# Altium project MPPT design board.PrjPcb
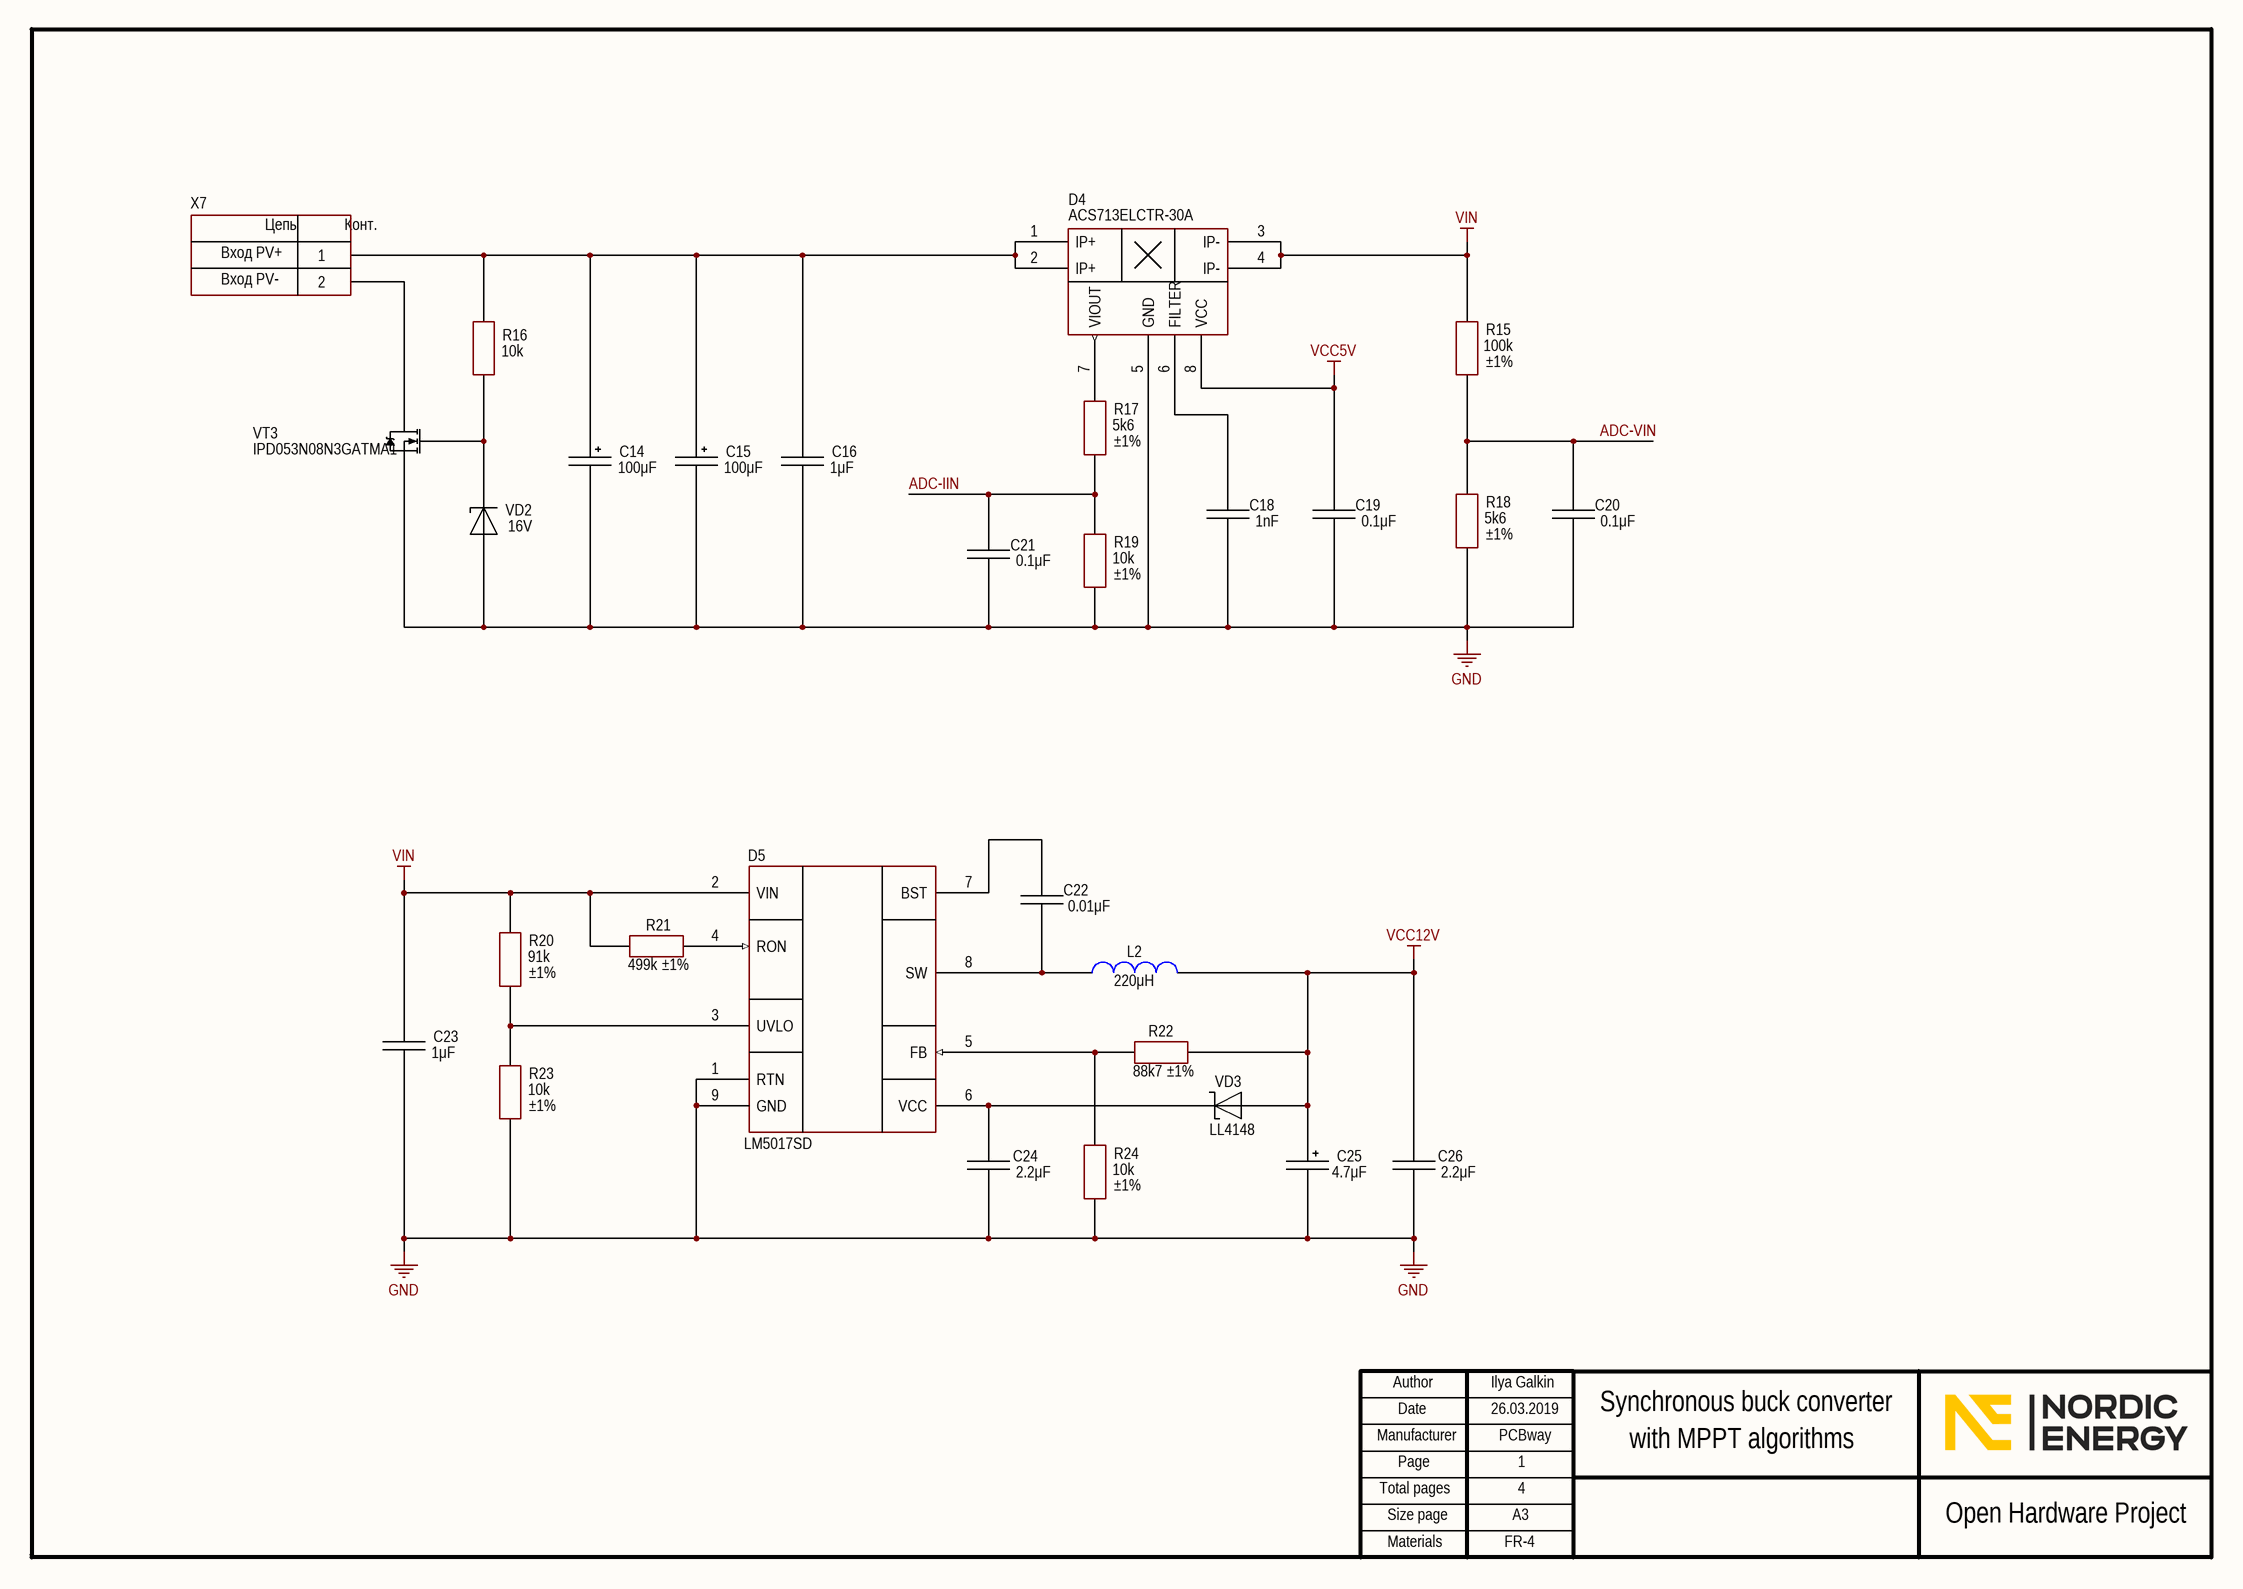
[diagram p0: Input circuits. Page 1.SchDoc]
4 sheets, 93 parts. Net scope: global (net labels, ports and power ports of the same name join across sheets).
Board file: PCB for MPPT design board.PcbDoc
Sheets:
  Input circuits. Page 1.SchDoc
  Buck converter. Page 2.SchDoc
  Output curcuits. Page 3.SchDoc
  Control board. Page 4.SchDoc

## Sheet Input circuits. Page 1.SchDoc
size 420 x 297 mm; Address1: Address1; Address2: Address2; Address3: Address3; Address4: Address4; DocumentNumber: АБВГ.123456.001 Э3; SheetNumber: 1; SheetTotal: 4; Scale: 1:1; DocumentType: Схема электрическая принципиальная; FirstReferrence: АБВГ.123456.001

### Parts
C14  100μF  [D10C5H12.5]
C15  100μF  [D10C5H12.5]
C16  1μF  [CH1206C]
C18  1nF  [CH0805C]
C19  0.1μF  [CH0805C]
C20  0.1μF  [CH0805C]
C21  0.1μF  [CH0805C]
C22  0.01μF  [CH0805C]
C23  1μF  [CH1206C]
C24  2.2μF  [CH0805C]
C25  4.7μF  [TANTAL_B]
C26  2.2μF  [CH0805C]
D4  ACS713ELCTR-30A  [8-SOIC]
D5  LM5017SD  [8-WDFN (4x4 mm)]
L2  220μH  [IND: SDR0805]
R15  100k  ComponentKind: ±1%  [CH0805R]
R16  10k  [CH0805R]
R17  5k6  ComponentKind: ±1%  [CH0805R]
R18  5k6  ComponentKind: ±1%  [CH0805R]
R19  10k  ComponentKind: ±1%  [CH0805R]
R20  91k  ComponentKind: ±1%  [CH0805R]
R21  499k  ComponentKind: ±1%  [CH0805R]
R22  88k7  ComponentKind: ±1%  [CH0805R]
R23  10k  ComponentKind: ±1%  [CH0805R]
R24  10k  ComponentKind: ±1%  [CH0805R]
VD2  16V  [SOD80]
VD3  LL4148  [SOD80]
VT3  IPD053N08N3GATMA1  [D2PAK]
X7  6PCV-02-006  [CON: 6PCV-02-006]  (value not drawn)

### Nets
GND: C14.2 C15.2 C16.2 C18.1 C19.1 C20.1 C21.1 C23.2 C24.1 C25.2 C26.1 D4.5(GND) D5.1(RTN) D5.9(GND) R18.1 R19.1 R23.1 R24.1 VD2.1(A) VT3.3(S)
VCC5V: C19.2 D4.8(VCC)
VCC12V: C25.1 C26.2 L2.1 R22.1 VD3.1
VIN: C23.1 D4.3(IP-) D4.4(IP-) D5.2(VIN) R15.2 R20.2 R21.2
ADC-IIN: C21.2 R17.1 R19.2
ADC-VIN: C20.2 R15.1 R18.2
NetC14_1: C14.1 C15.1 C16.1 D4.1(IP+) D4.2(IP+) R16.2 X7.1
NetC18_2: C18.2 D4.6(FILTER)
NetC22_1: C22.1 D5.8(SW) L2.2
NetC22_2: C22.2 D5.7(BST)
NetC24_2: C24.2 D5.6(VCC) VD3.2
NetD4_7: D4.7(VIOUT) R17.2
NetD5_3: D5.3(UVLO) R20.1 R23.2
NetD5_4: D5.4(RON) R21.1
NetD5_5: D5.5(FB) R22.2 R24.2
NetR16_1: R16.1 VD2.2(C) VT3.1(G)
NetVT3_2: VT3.2(D) X7.2

### Notes on the sheet
- Вход PV+
- Вход PV-
- Ilya Galkin
- 26.03.2019
- PCBway
- 1
- Synchronous buck converter
- with MPPT algorithms
- 4
- FR-4
- Author
- Manufacturer
- Date
- Page
- Total pages
- Size page
- A3
- Open Hardware Project
- Materials
- (in symbol 2-Connector) Цепь; Конт.

### Library data of the parts
C14 C15 = AlumCap: Manufacturer: Wurth; Model: 860010775014; HelpURL: https://www.digikey.com/product-detail/en/wurth-electronics-inc/860010775014/732-8771-1-ND/5728718; ComponentKind: 63V; Value: 100μF
C16 C23 = Capacitor: Manufacturer: Samsung; Model: CL31B105KCHSNNE; HelpURL: https://www.digikey.com/product-detail/en/samsung-electro-mechanics/CL31B105KCHSNNE/1276-2747-1-ND/3890833; ComponentKind: X7R; Value: 1μF
C18 = Capacitor: Manufacturer: Yageo; Model: CC0805KRX7R9BB102; HelpURL: https://www.digikey.com/product-detail/en/yageo/CC0805KRX7R9BB102/311-1127-1-ND/303037; ComponentKind: X7R; Value: 1nF
C19-C21 = Capacitor: Manufacturer: Yageo; Model: CC0805KRX7R8BB104; HelpURL: https://www.digikey.com/product-detail/en/yageo/CC0805KRX7R8BB104/311-1141-1-ND/303051; ComponentKind: X7R; Value: 0.1μF
C22 = Capacitor: Manufacturer: Yageo; Model: CC0805KRX7R9BB103; HelpURL: https://www.digikey.com/product-detail/en/yageo/CC0805KRX7R9BB103/311-1136-1-ND/303046; ComponentKind: X7R; Value: 0.01μF
C24 C26 = Capacitor: Manufacturer: Yageo; Model: CC0805KKX7R7BB225; HelpURL: https://www.digikey.com/product-detail/en/yageo/CC0805KKX7R7BB225/311-1881-1-ND/5195783; ComponentKind: X7R; Value: 2.2μF
C25 = TantalCap: Manufacturer: AVX; Model: TAJA475K025RNJ; HelpURL: https://www.digikey.com/product-detail/en/avx-corporation/TAJA475K025RNJ/478-11053-1-ND/7536161; ComponentKind: 25V; Value: 4.7μF
D4 = ACS713ELCTR-30A-T: Sensor; Manufacturer: Allegro MicroSystems, LLC; Model: ACS713ELCTR-30A-T; HelpURL: https://www.digikey.com/product-detail/en/allegro-microsystems-llc/ACS713ELCTR-30A-T/620-1193-1-ND/1284610; ComponentKind: 8-SOIC
D5 = LM5017SD: Step-down; Manufacturer: Texas Instruments; Model: LM5017SD/NOPB; HelpURL: https://www.digikey.com/product-detail/en/texas-instruments/LM5017SD-NOPB/LM5017SD-NOPBCT-ND/3137455; ComponentKind: 8-WDFN
L2 = Inductor: Manufacturer: Bourns; Model: SDR0805-221KL; HelpURL: https://www.digikey.com/product-detail/en/bourns-inc/SDR0805-221KL/SDR0805-221KLCT-ND/2127164; ComponentKind: 490mA; Value: 220μH
R15 = Resistor: Manufacturer: Yageo; Model: RC0805FR-07100KL; HelpURL: https://www.digikey.com/product-detail/en/yageo/RC0805FR-07100KL/311-100KCRCT-ND/730491; Value: 100k
R16 = Resistor: Manufacturer: Yageo; Model: RC0805JR-0710KL; HelpURL: https://www.digikey.com/product-detail/en/yageo/RC0805JR-0710KL/311-10KARCT-ND/731188; ComponentKind: ±5%; Value: 10k
R17 R18 = Resistor: Manufacturer: Yageo; Model: RC0805FR-075K6L; HelpURL: https://www.digikey.com/product-detail/en/yageo/RC0805FR-075K6L/311-5.60KCRCT-ND/730949; Value: 5k6
R19 R23 R24 = Resistor: Manufacturer: Yageo; Model: RC0805FR-0710KL; HelpURL: https://www.digikey.com/product-detail/en/yageo/RC0805FR-0710KL/311-10.0KCRCT-ND/730482; Value: 10k
R20 = Resistor: Manufacturer: Yageo; Model: RC0805FR-0791KL; HelpURL: https://www.digikey.com/product-detail/en/yageo/RC0805FR-0791KL/311-91.0KCRCT-ND/731149; Value: 91k
R21 = Resistor: Manufacturer: Yageo; Model: RC0805FR-07499KL; HelpURL: https://www.digikey.com/product-detail/en/yageo/RC0805FR-07499KL/311-499KCRCT-ND/730934; Value: 499k
R22 = Resistor: Manufacturer: Yageo; Model: RC0805FR-0788K7L; HelpURL: https://www.digikey.com/product-detail/en/yageo/RC0805FR-0788K7L/311-88.7KCRCT-ND/731128; Value: 88k7
VD2 = Diod Zener: Manufacturer: Central Semiconductor; Model: CLL5246B TR; ComponentKind: 16V; HelpURL: https://www.digikey.com/product-detail/en/central-semiconductor-corp/CLL5246B-TR/CLL5246BCT-ND/5324392
VD3 = Diod Schottky: Manufacturer: ON Semiconductor; ComponentKind: 100V; Model: LL4148; HelpURL: https://www.digikey.com/product-detail/en/on-semiconductor/LL4148/LL4148FSCT-ND/1923118
VT3 = N-chanel: Mosfet; Manufacturer: Infineon; Model: IPD053N08N3GATMA1; ComponentKind: 80V; HelpURL: https://www.digikey.com/product-detail/en/infineon-technologies/IPD053N08N3GATMA1/IPD053N08N3GATMA1CT-ND/5353500
X7 = 2-Connector: Manufacturer: TE Connectivity; Model: 6PCV-02-006; HelpURL: https://www.digikey.com/products/en?keywords=6pcv-02-006; ComponentKind: 25A

## Sheet Buck converter. Page 2.SchDoc
size 420 x 297 mm; Address1: Address1; Address2: Address2; Address3: Address3; Address4: Address4; DocumentNumber: АБВГ.123456.001 Э3; SheetNumber: 2; SheetTotal: 4; Scale: 1:1; DocumentType: Схема электрическая принципиальная; FirstReferrence: АБВГ.123456.001
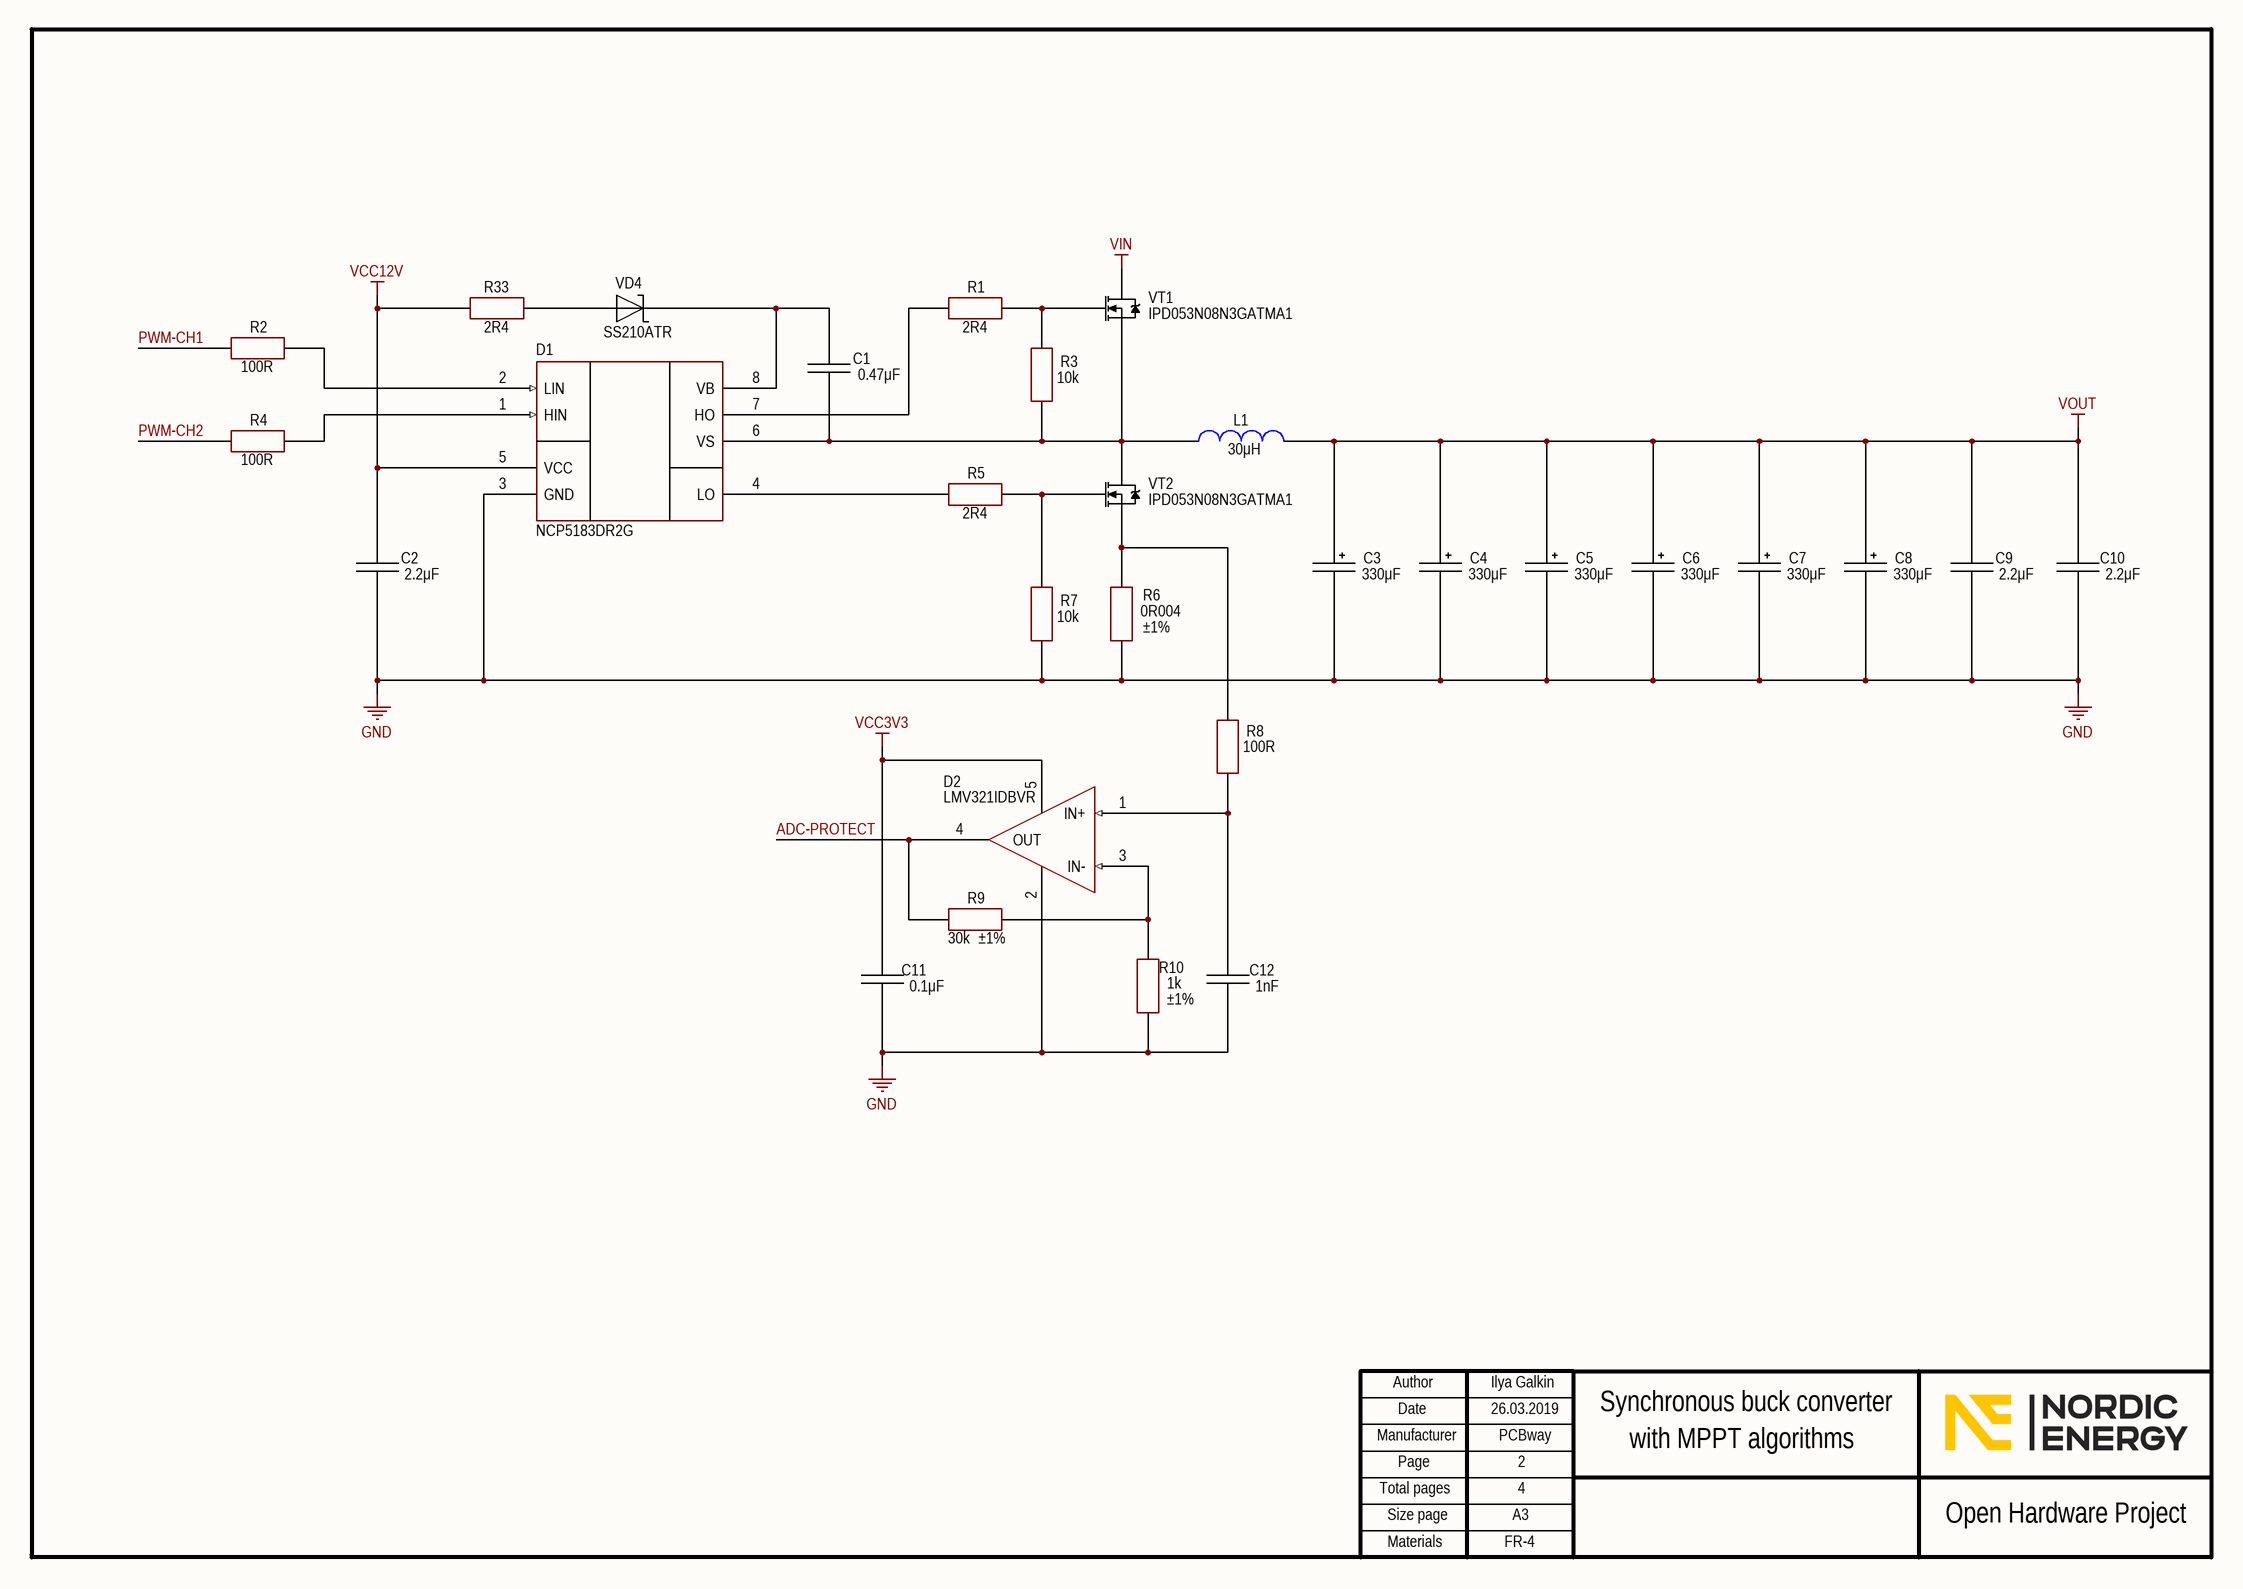
[diagram p1: Buck converter. Page 2.SchDoc]

### Parts
C1  0.47μF  [CH1206C]
C2  2.2μF  [CH1206C]
C3  330μF  [D10C5H12.5]
C4  330μF  [D10C5H12.5]
C5  330μF  [D10C5H12.5]
C6  330μF  [D10C5H12.5]
C7  330μF  [D10C5H12.5]
C8  330μF  [D10C5H12.5]
C9  2.2μF  [CH1206C]
C10  2.2μF  [CH1206C]
C11  0.1μF  [CH0805C]
C12  1nF  [CH0805C]
D1  NCP5183DR2G  [8-SOIC]
D2  LMV321IDBVR  [SOT23-5]
L1  30μH  [IND: R32.8/20.1/10.7 (L)]
R1  2R4  [CH0805R]
R2  100R  [CH0805R]
R3  10k  [CH0805R]
R4  100R  [CH0805R]
R5  2R4  [CH0805R]
R6  0R004  ComponentKind: ±1%  [CH2512R]
R7  10k  [CH0805R]
R8  100R  [CH0805R]
R9  30k  ComponentKind: ±1%  [CH0805R]
R10  1k  ComponentKind: ±1%  [CH0805R]
R33  2R4  [CH0805R]
VD4  SS210ATR  [SMA]
VT1  IPD053N08N3GATMA1  [D2PAK]
VT2  IPD053N08N3GATMA1  [D2PAK]

### Nets
GND: C2.1 C3.2 C4.2 C5.2 C6.2 C7.2 C8.2 C9.1 C10.1 C11.1 C12.1 D1.3(GND) D2.2(V-) R6.2 R7.1 R10.2
VCC3V3: C11.2 D2.5(V+)
VCC12V: C2.2 D1.5(VCC) R33.2
VIN: VT1.2(D)
VOUT: C3.1 C4.1 C5.1 C6.1 C7.1 C8.1 C9.2 C10.2 L1.1
ADC-PROTECT: D2.4(OUT) R9.2
PWM-CH1: R2.1
PWM-CH2: R4.1
NetC1_1: C1.1 D1.6(VS) L1.2 R3.1 VT1.3(S) VT2.2(D)
NetC1_2: C1.2 D1.8(VB) VD4.2
NetC12_2: C12.2 D2.1(IN+) R8.2
NetD1_1: D1.1(HIN) R4.2
NetD1_2: D1.2(LIN) R2.2
NetD1_4: D1.4(LO) R5.2
NetD1_7: D1.7(HO) R1.2
NetD2_3: D2.3(IN-) R9.1 R10.1
NetR1_1: R1.1 R3.2 VT1.1(G)
NetR5_1: R5.1 R7.2 VT2.1(G)
NetR6_1: R6.1 R8.1 VT2.3(S)
NetR33_1: R33.1 VD4.1

### Notes on the sheet
- Ilya Galkin
- 26.03.2019
- PCBway
- 2
- Synchronous buck converter
- with MPPT algorithms
- 4
- FR-4
- Author
- Manufacturer
- Date
- Page
- Total pages
- Size page
- A3
- Open Hardware Project
- Materials

### Library data of the parts
C1 = Capacitor: Manufacturer: Yageo; Model: CC1206KRX7R8BB474; HelpURL: https://www.digikey.com/product-detail/en/yageo/CC1206KRX7R8BB474/311-3576-1-ND/7648503; ComponentKind: X7R; Value: 0.47μF
C2 C9 C10 = Capacitor: Manufacturer: Yageo; Model: CC1206KKX7R9BB225; HelpURL: https://www.digikey.com/product-detail/en/yageo/CC1206KKX7R9BB225/311-1964-1-ND/5195866; ComponentKind: X7R; Value: 2.2μF
C3-C8 = AlumCap: Manufacturer: Panasonic; Model: 35SEK330M; HelpURL: https://www.digikey.com/product-detail/en/panasonic-electronic-components/35SEK330M/P122629-ND/8030545; ComponentKind: 35V; Value: 330μF
C11 = Capacitor: as C19 on sheet Input circuits. Page 1; HelpURL: https://www.digikey.com/product-detail/en/yageo/CC0805KRX7R8BB104/311-1141-1-ND/303051; ComponentKind: X7R; Value: 0.1μF
C12 = Capacitor: as C18 on sheet Input circuits. Page 1; HelpURL: https://www.digikey.com/product-detail/en/yageo/CC0805KRX7R9BB102/311-1127-1-ND/303037; ComponentKind: X7R; Value: 1nF
D1 = NCP5183DR2G: Half-bridge; Manufacturer: ON Semiconductor; Model: NCP5183DR2G; HelpURL: https://www.digikey.com/product-detail/en/on-semiconductor/NCP5183DR2G/NCP5183DR2GOSCT-ND/7066807; ComponentKind: SO-8
D2 = LMV321IDBVR: Amplifer; Manufacturer: Texas Instruments; Model: LMV321IDBVR; ComponentKind: SOT-23-5; HelpURL: https://www.digikey.com/product-detail/en/texas-instruments/LMV321IDBVR/296-9567-1-ND/379849
L1 = Inductor ring: Manufacturer: Magnetics; Model: 0077071A7; Value: 30μH; ComponentKind: R32.8x20.1x10.7; HelpURL: http://ferrite.ru/warehouse/r-32-820-110-7-77071-a7.html
R1 R5 R33 = Resistor: Manufacturer: Yageo; Model: RC0805JR-072R4L; HelpURL: https://www.digikey.com/product-detail/en/yageo/RC0805JR-072R4L/311-2.4ARCT-ND/731220; ComponentKind: ±5%; Value: 2R4
R2 R4 R8 = Resistor: Manufacturer: Yageo; Model: RC0805JR-07100RL; HelpURL: https://www.digikey.com/product-detail/en/yageo/RC0805JR-07100RL/311-100ARCT-ND/731185; ComponentKind: ±5%; Value: 100R
R3 R7 = Resistor: as R16 on sheet Input circuits. Page 1; HelpURL: https://www.digikey.com/product-detail/en/yageo/RC0805JR-0710KL/311-10KARCT-ND/731188; ComponentKind: ±5%; Value: 10k
R6 = Resistor: Manufacturer: Yageo; Model: PA2512FKF7W0R004E; HelpURL: https://www.digikey.com/product-detail/en/yageo/PA2512FKF7W0R004E/YAG2144CT-ND/5139592; Value: 0R004
R9 = Resistor: Manufacturer: Yageo; Model: RC0805FR-0730KL; HelpURL: https://www.digikey.com/product-detail/en/yageo/RC0805FR-0730KL/311-30.0KCRCT-ND/730790; Value: 30k
R10 = Resistor: Manufacturer: Yageo; Model: RC0805FR-071KL; HelpURL: https://www.digikey.com/product-detail/en/yageo/RC0805FR-071KL/311-1.00KCRCT-ND/730391; Value: 1k
VD4 = Diod Schottky: Manufacturer: SMC Diode; ComponentKind: 100V 2A; Model: SS210ATR; HelpURL: https://www.digikey.com/product-detail/en/smc-diode-solutions/SS210ATR/1655-1896-1-ND/7914879
VT1 VT2 = N-chanel: Mosfet; Manufacturer: Infineon; Model: IPD053N08N3GATMA1; ComponentKind: 80V; HelpURL: https://www.digikey.com/product-detail/en/infineon-technologies/IPD053N08N3GATMA1/IPD053N08N3GATMA1CT-ND/5353500

## Sheet Output curcuits. Page 3.SchDoc
size 420 x 297 mm; Address1: Address1; Address2: Address2; Address3: Address3; Address4: Address4; DocumentNumber: АБВГ.123456.001 Э3; SheetNumber: 3; SheetTotal: 4; Scale: 1:1; DocumentType: Схема электрическая принципиальная; FirstReferrence: АБВГ.123456.001
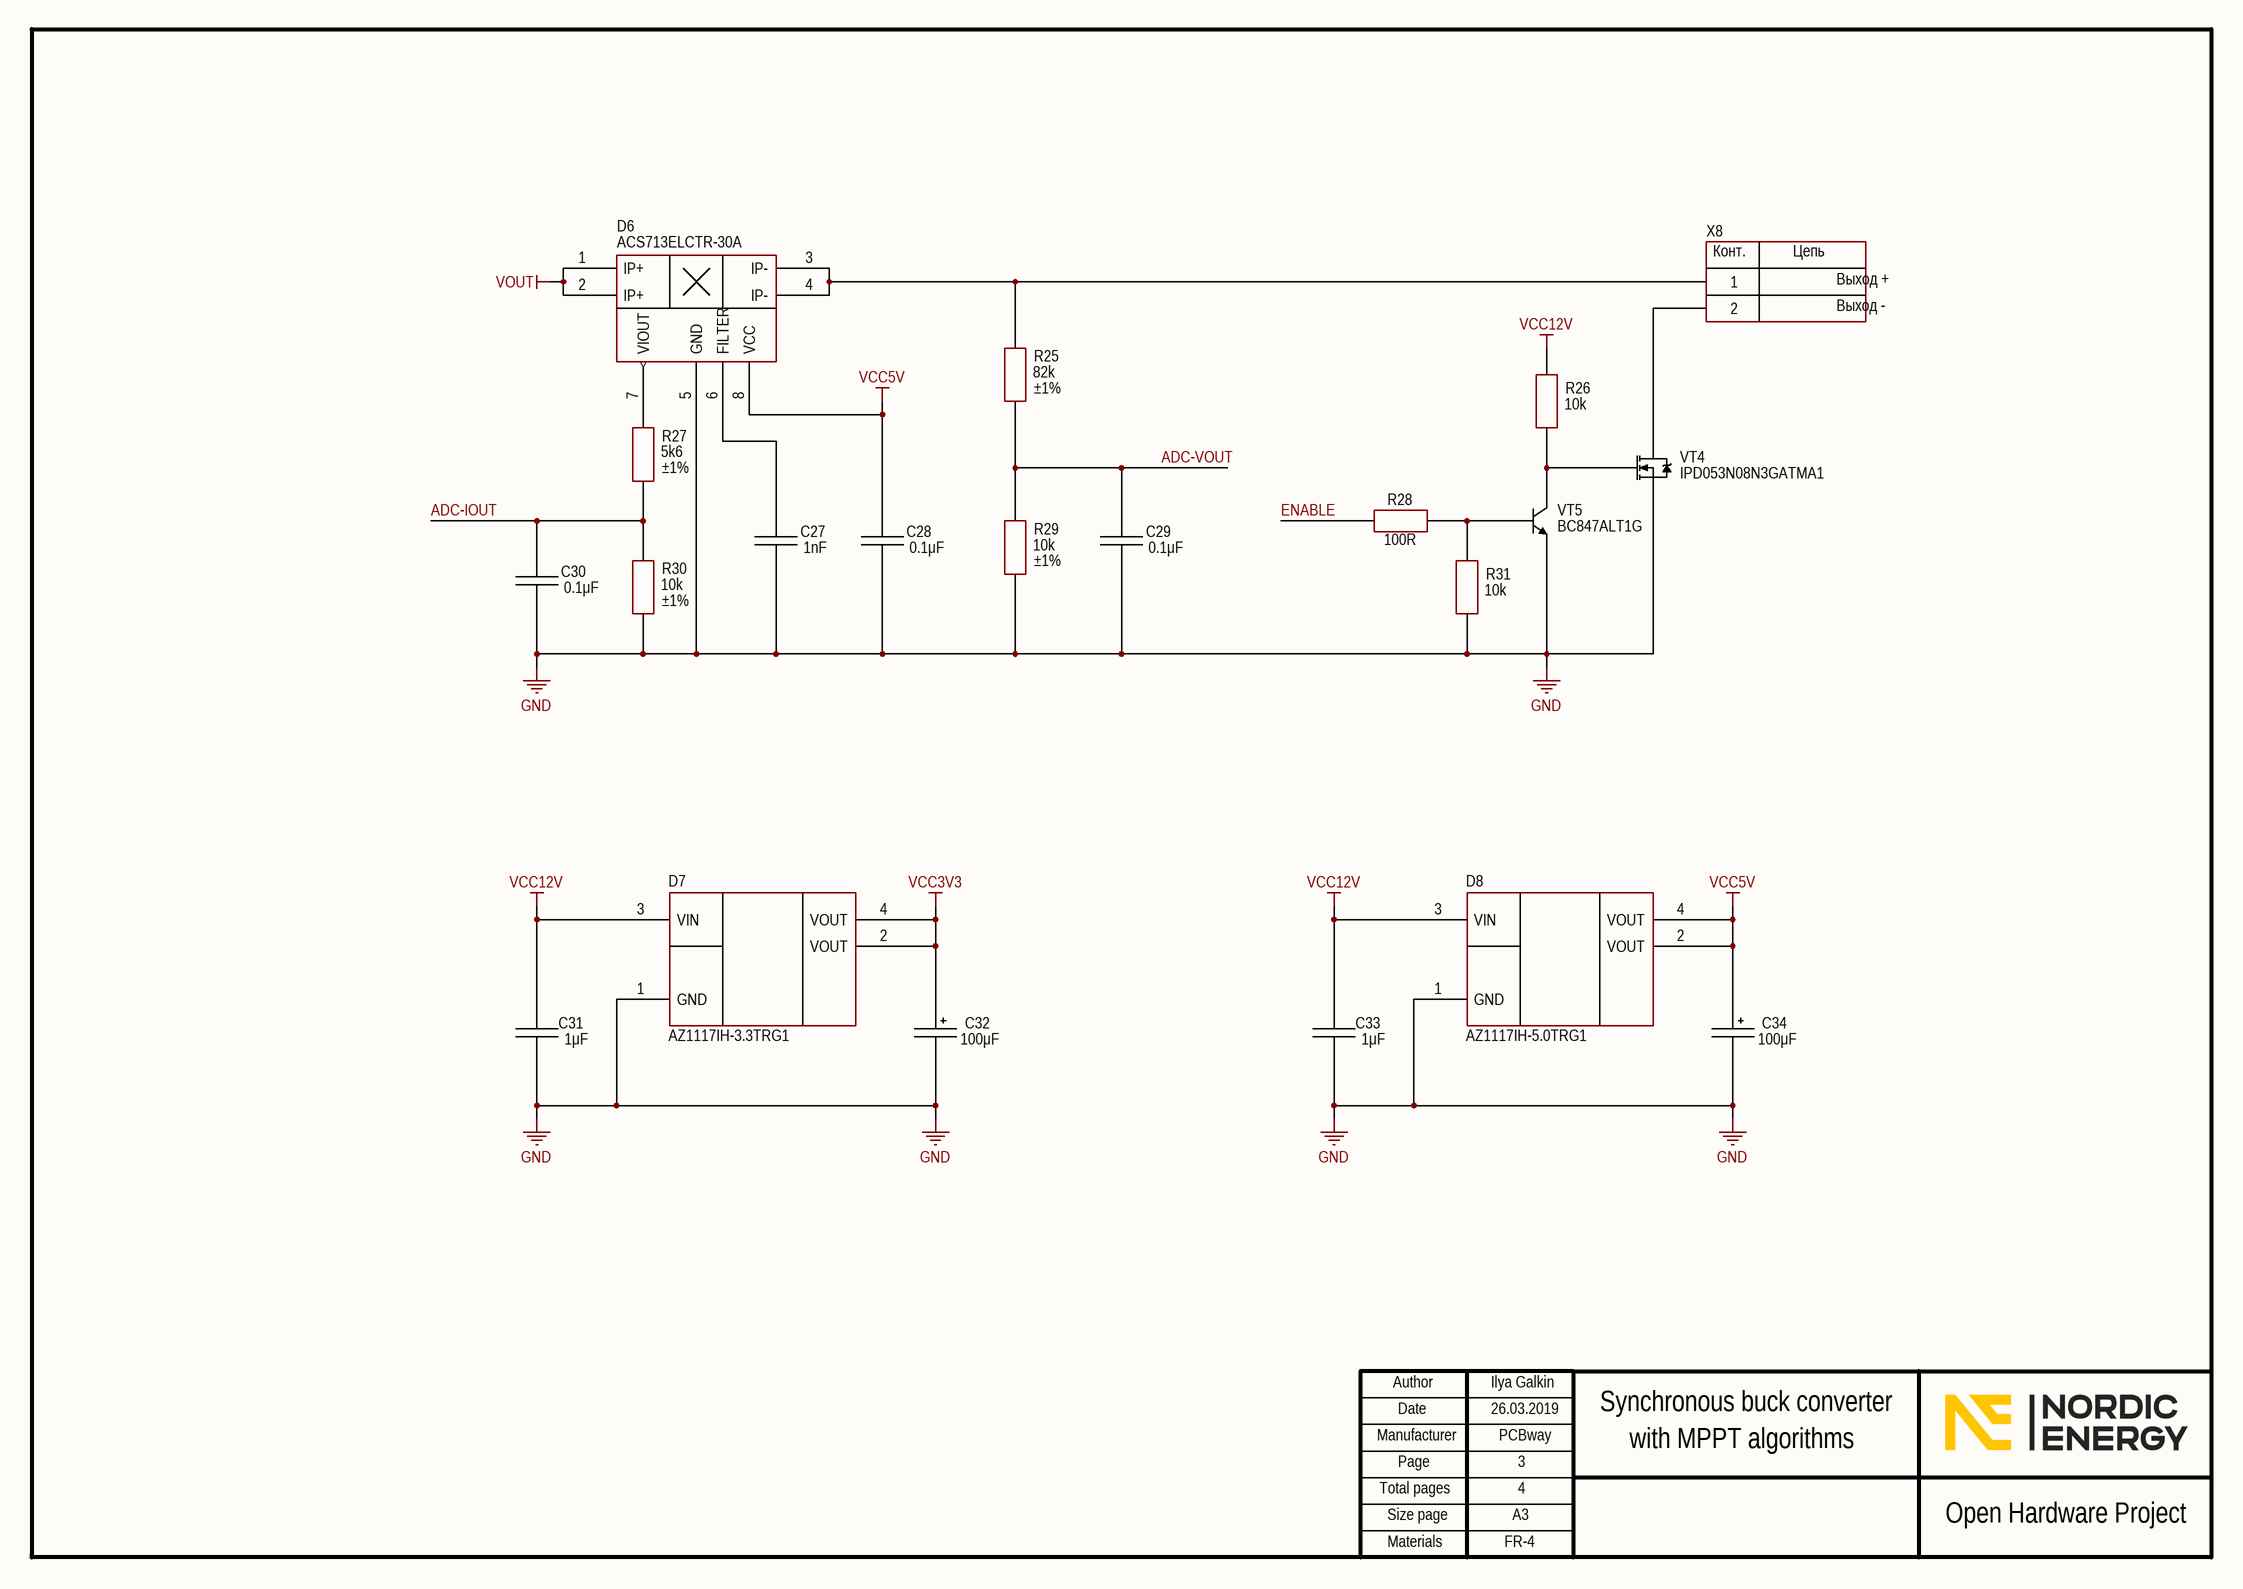
[diagram p2: Output curcuits. Page 3.SchDoc]

### Parts
C27  1nF  [CH0805C]
C28  0.1μF  [CH0805C]
C29  0.1μF  [CH0805C]
C30  0.1μF  [CH0805C]
C31  1μF  [CH0805C]
C32  100μF  [TANTAL_A]
C33  1μF  [CH0805C]
C34  100μF  [TANTAL_A]
D6  ACS713ELCTR-30A  [8-SOIC]
D7  AZ1117IH-3.3TRG1  [SOT223]
D8  AZ1117IH-5.0TRG1  [SOT223]
R25  82k  ComponentKind: ±1%  [CH0805R]
R26  10k  [CH0805R]
R27  5k6  ComponentKind: ±1%  [CH0805R]
R28  100R  [CH0805R]
R29  10k  ComponentKind: ±1%  [CH0805R]
R30  10k  ComponentKind: ±1%  [CH0805R]
R31  10k  [CH0805R]
VT4  IPD053N08N3GATMA1  [D2PAK]
VT5  BC847ALT1G  [SOT23_123]
X8  6PCV-02-006  [CON: 6PCV-02-006]  (value not drawn)

### Nets
GND: C27.1 C28.1 C29.1 C30.1 C31.1 C32.2 C33.1 C34.2 D6.5(GND) D7.1(GND) D8.1(GND) R29.1 R30.1 R31.1 VT4.3(S) VT5.3(E)
VCC3V3: C32.1 D7.2(VOUT) D7.4(VOUT)
VCC5V: C28.2 C34.1 D6.8(VCC) D8.2(VOUT) D8.4(VOUT)
VCC12V: C31.2 C33.2 D7.3(VIN) D8.3(VIN) R26.2
VOUT: D6.1(IP+) D6.2(IP+)
ADC-IOUT: C30.2 R27.1 R30.2
ADC-VOUT: C29.2 R25.1 R29.2
ENABLE: R28.1
NetC27_2: C27.2 D6.6(FILTER)
NetD6_3: D6.3(IP-) D6.4(IP-) R25.2 X8.1
NetD6_7: D6.7(VIOUT) R27.2
NetR26_1: R26.1 VT4.1(G) VT5.2(C)
NetR28_2: R28.2 R31.2 VT5.1(B)
NetVT4_2: VT4.2(D) X8.2

### Notes on the sheet
- Выход +
- Выход -
- Ilya Galkin
- 26.03.2019
- PCBway
- 3
- Synchronous buck converter
- with MPPT algorithms
- 4
- FR-4
- Author
- Manufacturer
- Date
- Page
- Total pages
- Size page
- A3
- Open Hardware Project
- Materials
- (in symbol 2-Connector) Конт.; Цепь

### Library data of the parts
C27 = Capacitor: as C18 on sheet Input circuits. Page 1; HelpURL: https://www.digikey.com/product-detail/en/yageo/CC0805KRX7R9BB102/311-1127-1-ND/303037; ComponentKind: X7R; Value: 1nF
C28-C30 = Capacitor: as C19 on sheet Input circuits. Page 1; HelpURL: https://www.digikey.com/product-detail/en/yageo/CC0805KRX7R8BB104/311-1141-1-ND/303051; ComponentKind: X7R; Value: 0.1μF
C31 C33 = Capacitor: Manufacturer: Yageo; Model: CC0805JKX7R7BB105; HelpURL: https://www.digikey.com/product-detail/en/yageo/CC0805JKX7R7BB105/311-3497-1-ND/7164518; ComponentKind: X7R; Value: 1μF
C32 C34 = TantalCap: Manufacturer: AVX; Model: TLJA107M006R0800; HelpURL: https://www.digikey.com/product-detail/en/avx-corporation/TLJA107M006R0800/478-11096-1-ND/7536303; ComponentKind: 6.3V; Value: 100μF
D6 = ACS713ELCTR-30A-T: as D4 on sheet Input circuits. Page 1; Model: ACS713ELCTR-30A-T; HelpURL: https://www.digikey.com/product-detail/en/allegro-microsystems-llc/ACS713ELCTR-30A-T/620-1193-1-ND/1284610; ComponentKind: 8-SOIC
D7 D8 = LDL1117S33R: LDO; Manufacturer: Diodes Incorporated; ComponentKind: SOT-223
  D7: Model: AZ1117IH-3.3TRG1; HelpURL: https://www.digikey.com/product-detail/en/diodes-incorporated/AZ1117IH-3.3TRG1/AZ1117IH-3.3TRG1DIDKR-ND/5699692
  D8: Model: AZ1117IH-5.0TRG1; HelpURL: https://www.digikey.com/product-detail/en/diodes-incorporated/AZ1117IH-5.0TRG1/AZ1117IH-5.0TRG1DICT-ND/5699683
R25 = Resistor: Manufacturer: Yageo; Model: RC0805FR-0782KL; HelpURL: https://www.digikey.com/product-detail/en/yageo/RC0805FR-0782KL/311-82.0KCRDKR-ND/734059; Value: 82k
R26 R31 = Resistor: as R16 on sheet Input circuits. Page 1; HelpURL: https://www.digikey.com/product-detail/en/yageo/RC0805JR-0710KL/311-10KARCT-ND/731188; ComponentKind: ±5%; Value: 10k
R27 = Resistor: as R17 on sheet Input circuits. Page 1; HelpURL: https://www.digikey.com/product-detail/en/yageo/RC0805FR-075K6L/311-5.60KCRCT-ND/730949; Value: 5k6
R28 = Resistor: as R2 on sheet Buck converter. Page 2; HelpURL: https://www.digikey.com/product-detail/en/yageo/RC0805JR-07100RL/311-100ARCT-ND/731185; ComponentKind: ±5%; Value: 100R
R29 R30 = Resistor: as R19 on sheet Input circuits. Page 1; HelpURL: https://www.digikey.com/product-detail/en/yageo/RC0805FR-0710KL/311-10.0KCRCT-ND/730482; Value: 10k
VT4 = N-chanel: Mosfet; Manufacturer: Infineon; Model: IPD053N08N3GATMA1; ComponentKind: 80V; HelpURL: https://www.digikey.com/product-detail/en/infineon-technologies/IPD053N08N3GATMA1/IPD053N08N3GATMA1CT-ND/5353500
VT5 = NPN: Bipolar; Manufacturer: ON Semiconductor; Model: BC847ALT1G; ComponentKind: 45V; HelpURL: https://www.digikey.com/product-detail/en/on-semiconductor/BC847ALT1G/BC847ALT1GOSCT-ND/917833
X8 = 2-Connector: Manufacturer: TE Connectivity; Model: 6PCV-02-006; HelpURL: https://www.digikey.com/products/en?keywords=6pcv-02-006; ComponentKind: 25A

## Sheet Control board. Page 4.SchDoc
size 420 x 297 mm; Address1: Address1; Address2: Address2; Address3: Address3; Address4: Address4; DocumentNumber: АБВГ.123456.001 Э3; SheetNumber: 4; SheetTotal: 4; Scale: 1:1; DocumentType: Схема электрическая принципиальная; FirstReferrence: АБВГ.123456.001
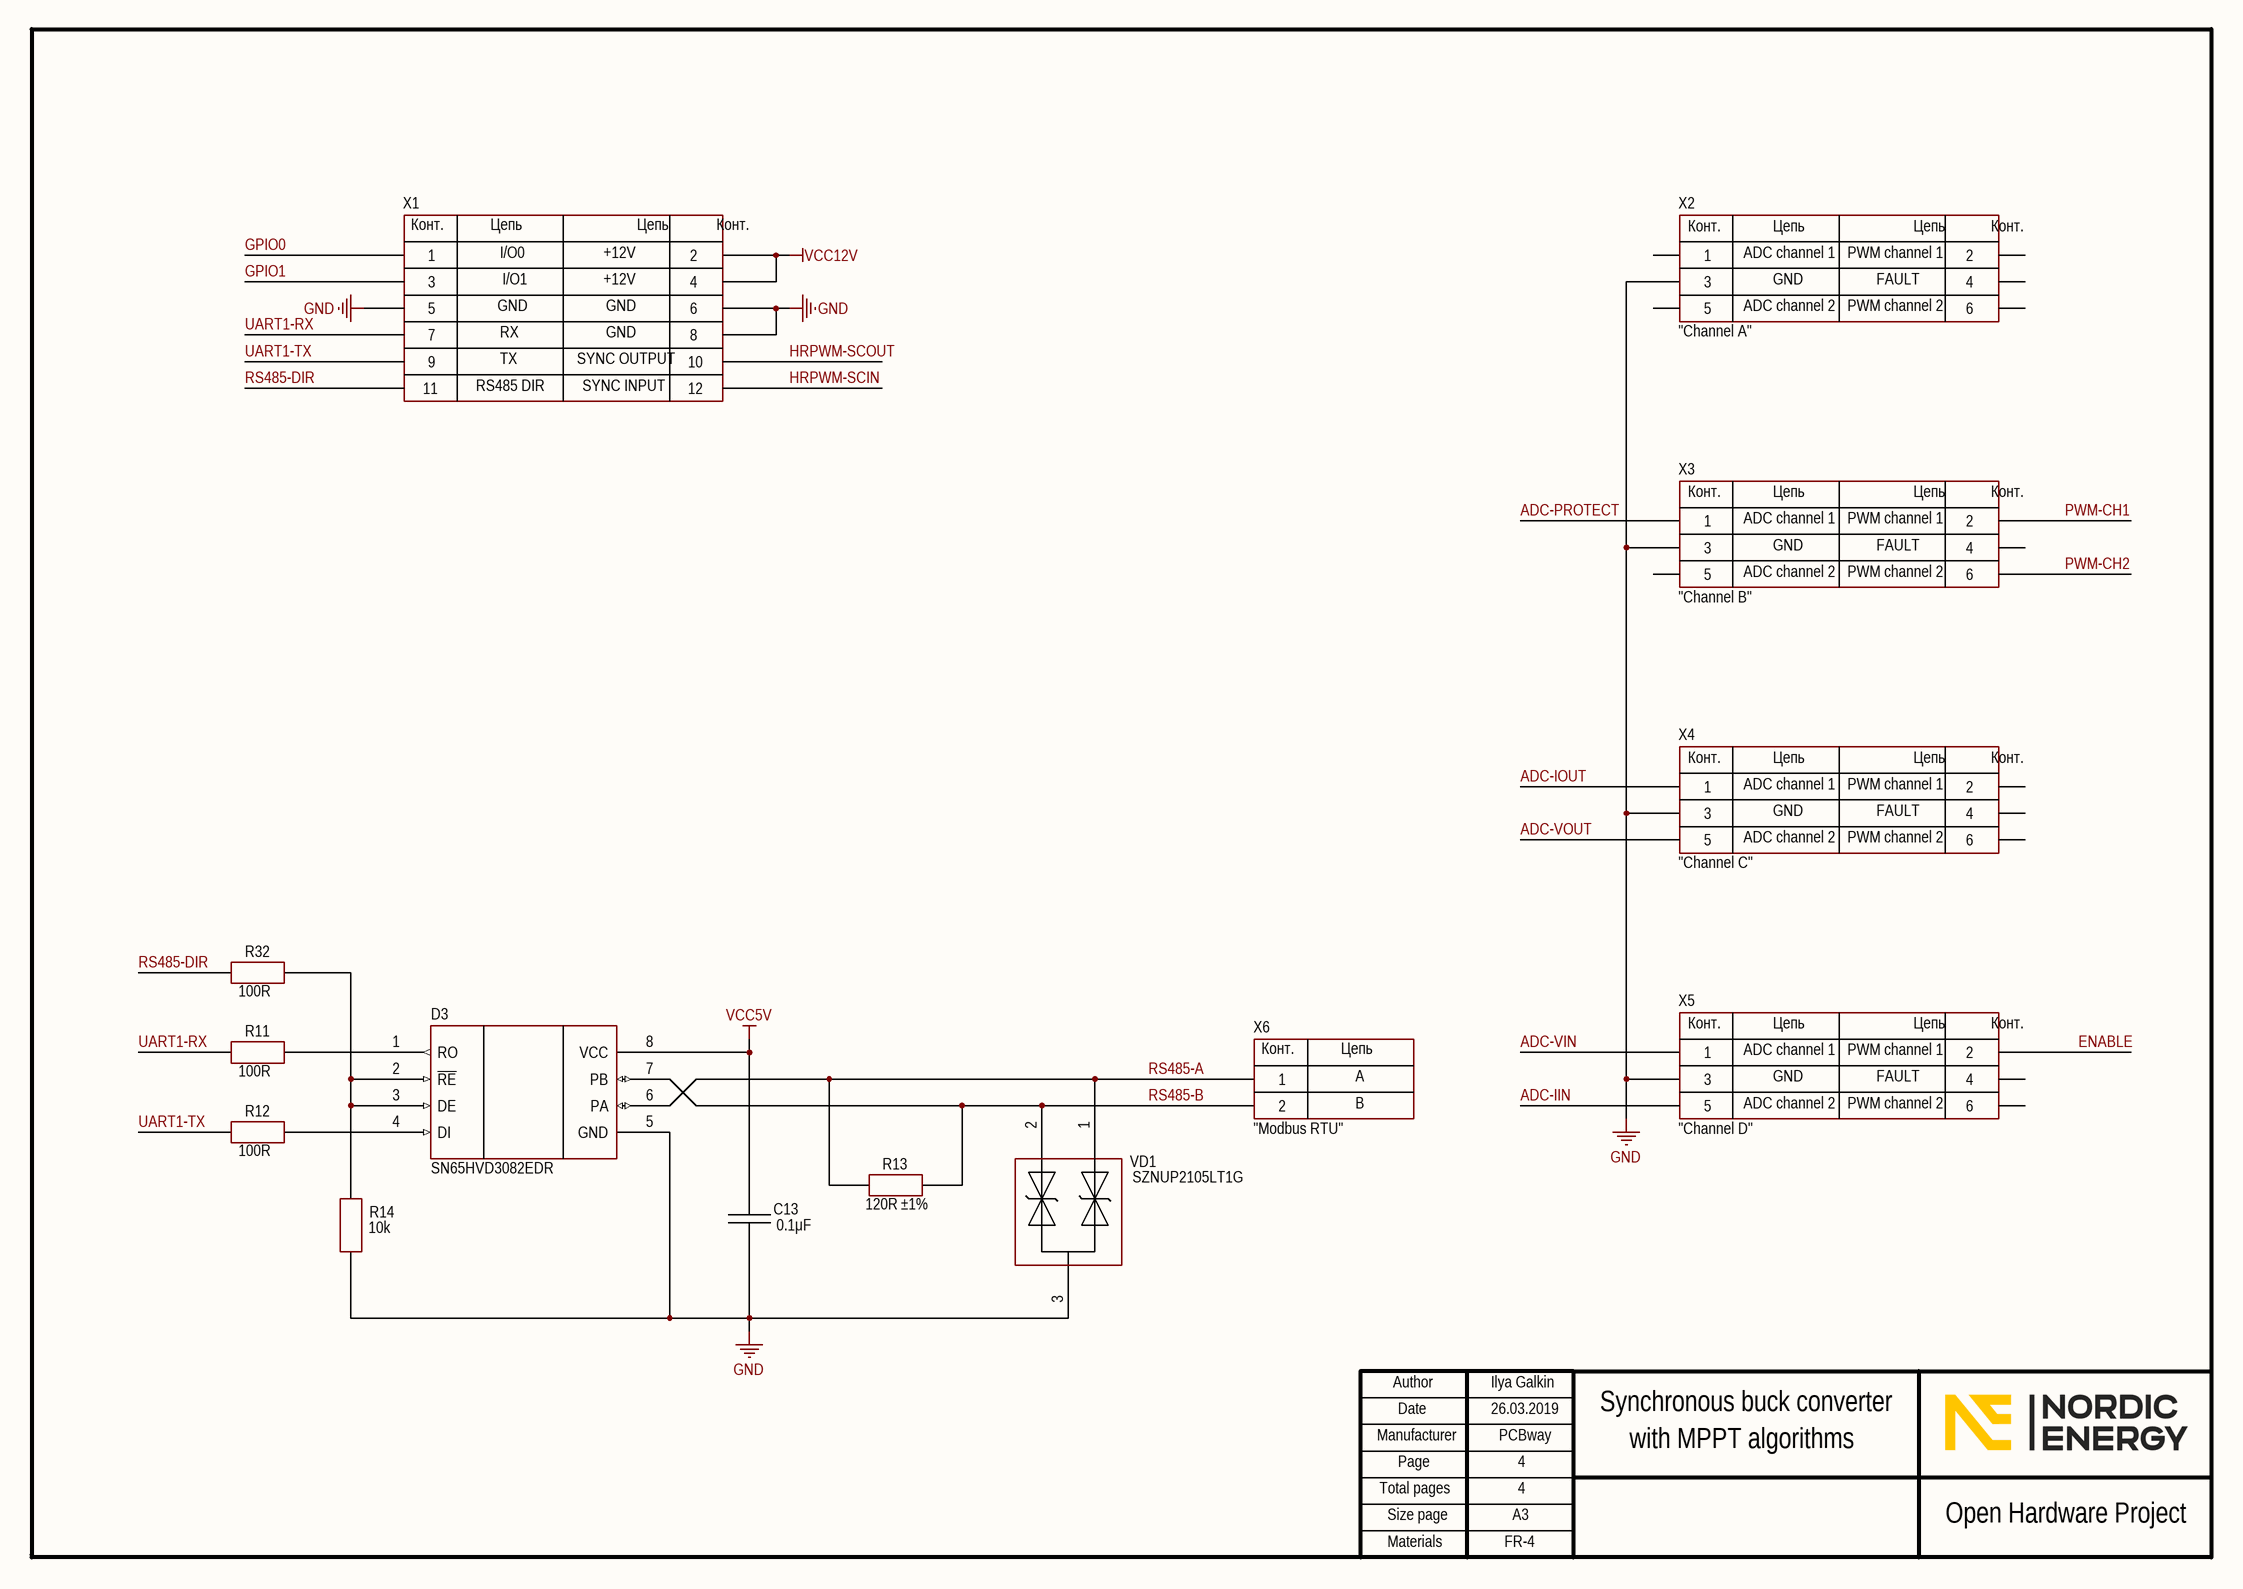
[diagram p3: Control board. Page 4.SchDoc]

### Parts
C13  0.1μF  [CH0805C]
D3  SN65HVD3082EDR  [8-SOIC]
R11  100R  [CH0805R]
R12  100R  [CH0805R]
R13  120R  ComponentKind: ±1%  [CH0805R]
R14  10k  [CH0805R]
R32  100R  [CH0805R]
VD1  SZNUP2105LT1G  [SOT23_132]
X1  *  [CON: PBD-12]  (value not drawn)
X2  "Channel A"  [CON: PBD-6]
X3  "Channel B"  [CON: PBD-6]
X4  "Channel C"  [CON: PBD-6]
X5  "Channel D"  [CON: PBD-6]
X6  "Modbus RTU"  [CON: 0395430002 (5 mm)]

### Nets
GND: C13.1 D3.5(GND) R14.1 VD1.3 X1.5 X1.6 X1.8 X2.3 X3.3 X4.3 X5.3
VCC5V: C13.2 D3.8(VCC)
VCC12V: X1.2 X1.4
ADC-IIN: X5.5
ADC-IOUT: X4.1
ADC-PROTECT: X3.1
ADC-VIN: X5.1
ADC-VOUT: X4.5
ENABLE: X5.2
GPIO0: X1.1
GPIO1: X1.3
HRPWM-SCIN: X1.12
HRPWM-SCOUT: X1.10
PWM-CH1: X3.2
PWM-CH2: X3.6
RS485-A: D3.6(PA) R13.1 VD1.1 X6.1
RS485-B: D3.7(PB) R13.2 VD1.2 X6.2
RS485-DIR: R32.2 X1.11
UART1-RX: R11.2 X1.7
UART1-TX: R12.2 X1.9
NetD3_1: D3.1(RO) R11.1
NetD3_2: D3.2(~{RE}) D3.3(DE) R14.2 R32.1
NetD3_4: D3.4(DI) R12.1

Not connected (* = marked no-connect by the designer): X2 1 2 4 5 6; X3 4 5; X4 2 4 6; X5 4 6

### Notes on the sheet
- (near X1) I/O0
- (near X1) +12V
- (near X2) ADC channel 1
- (near X2) PWM channel 1
- (near X1) GND
- (near X1) I/O1
- (near X2) ADC channel 2
- (near X2) GND
- (near X2) PWM channel 2
- (near X2) FAULT
- (near X1) RS485 DIR
- (near X1) TX
- (near X1) RX
- (near X1) SYNC OUTPUT
- (near X1) SYNC INPUT
- (near X3) ADC channel 1
- (near X3) PWM channel 1
- (near X3) ADC channel 2
- (near X3) GND
- (near X3) PWM channel 2
- (near X3) FAULT
- (near X4) ADC channel 1
- (near X4) PWM channel 1
- (near X4) ADC channel 2
- (near X4) GND
- (near X4) PWM channel 2
- (near X4) FAULT
- (near X5) ADC channel 1
- (near X5) PWM channel 1
- B
- A
- (near X5) ADC channel 2
- (near X5) GND
- (near X5) PWM channel 2
- (near X5) FAULT
- Ilya Galkin
- 26.03.2019
- PCBway
- 4
- Synchronous buck converter
- with MPPT algorithms
- FR-4
- Author
- Manufacturer
- Date
- Page
- Total pages
- Size page
- A3
- Open Hardware Project
- Materials
- (in symbol 2-Connector) Конт.; Цепь
- (in symbol 6(2)-Connector) Конт.; Цепь
- (in symbol 12-Connector (2)) Конт.; Цепь

### Library data of the parts
C13 = Capacitor: as C19 on sheet Input circuits. Page 1; HelpURL: https://www.digikey.com/product-detail/en/yageo/CC0805KRX7R8BB104/311-1141-1-ND/303051; ComponentKind: X7R; Value: 0.1μF
D3 = SN65HVD3082EDR: RS485; Manufacturer: Texas Instruments; Model: SN65HVD3082EDR; HelpURL: https://www.digikey.com/product-detail/en/texas-instruments/SN65HVD3082EDR/296-31719-1-ND/3505195; ComponentKind: 8-SOIC
R11 R12 R32 = Resistor: as R2 on sheet Buck converter. Page 2; HelpURL: https://www.digikey.com/product-detail/en/yageo/RC0805JR-07100RL/311-100ARCT-ND/731185; ComponentKind: ±5%; Value: 100R
R13 = Resistor: Manufacturer: Yageo; Model: RC0805FR-07120RL; HelpURL: https://www.digikey.com/product-detail/en/yageo/RC0805FR-07120RL/311-120CRCT-ND/730522; Value: 120R
R14 = Resistor: as R16 on sheet Input circuits. Page 1; HelpURL: https://www.digikey.com/product-detail/en/yageo/RC0805JR-0710KL/311-10KARCT-ND/731188; ComponentKind: ±5%; Value: 10k
VD1 = TVS Array: Manufacturer: ON Semiconductor; ComponentKind: 24V; Model: SZNUP2105LT1G; HelpURL: https://www.digikey.com/product-detail/en/on-semiconductor/SZNUP2105LT1G/SZNUP2105LT1GOSCT-ND/3487669
X1 = 12-Connector (2): Model: *; Manufacturer: *; HelpURL: *; ComponentKind: *
X2-X5 = 6(2)-Connector: Model: *; Manufacturer: *; HelpURL: *; ComponentKind: *
X6 = 2-Connector: Manufacturer: Molex; Model: 0395430002; HelpURL: https://www.digikey.com/products/en?keywords=0395430002; ComponentKind: 300V 10A

## Nets that join several sheets
GND: Input circuits. Page 1 (20 pins), Buck converter. Page 2 (16 pins), Output curcuits. Page 3 (16 pins), Control board. Page 4 (11 pins)
VCC3V3: Buck converter. Page 2 (C11.2 D2.5), Output curcuits. Page 3 (C32.1 D7.2 D7.4)
VCC5V: Input circuits. Page 1 (C19.2 D4.8), Output curcuits. Page 3 (5 pins), Control board. Page 4 (C13.2 D3.8)
VCC12V: Input circuits. Page 1 (5 pins), Buck converter. Page 2 (C2.2 D1.5 R33.2), Output curcuits. Page 3 (5 pins), Control board. Page 4 (X1.2 X1.4)
VIN: Input circuits. Page 1 (7 pins), Buck converter. Page 2 (VT1.2)
VOUT: Buck converter. Page 2 (9 pins), Output curcuits. Page 3 (D6.1 D6.2)
ADC-IIN: Input circuits. Page 1 (C21.2 R17.1 R19.2), Control board. Page 4 (X5.5)
ADC-IOUT: Output curcuits. Page 3 (C30.2 R27.1 R30.2), Control board. Page 4 (X4.1)
ADC-PROTECT: Buck converter. Page 2 (D2.4 R9.2), Control board. Page 4 (X3.1)
ADC-VIN: Input circuits. Page 1 (C20.2 R15.1 R18.2), Control board. Page 4 (X5.1)
ADC-VOUT: Output curcuits. Page 3 (C29.2 R25.1 R29.2), Control board. Page 4 (X4.5)
ENABLE: Output curcuits. Page 3 (R28.1), Control board. Page 4 (X5.2)
PWM-CH1: Buck converter. Page 2 (R2.1), Control board. Page 4 (X3.2)
PWM-CH2: Buck converter. Page 2 (R4.1), Control board. Page 4 (X3.6)